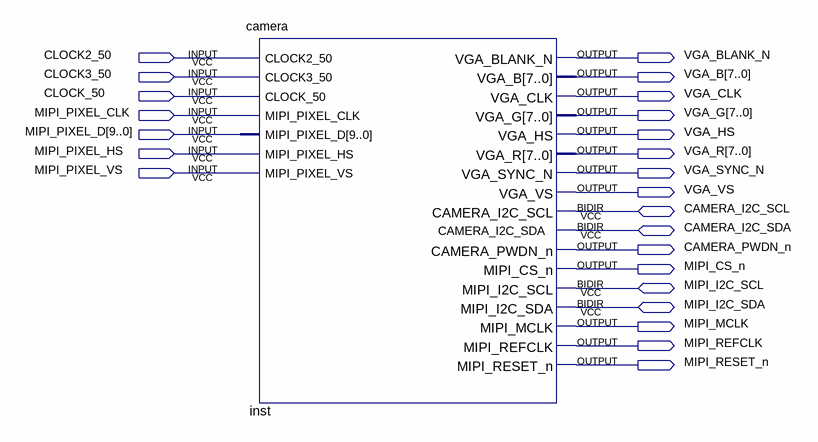
[diagram p0: schematic sheet]
// Quartus schematic test.bdf as structural Verilog: 1 symbols, 24 pins
module test (
  input  CLOCK2_50,
  input  CLOCK3_50,
  input  CLOCK_50,
  input  MIPI_PIXEL_CLK,
  input  [9:0] MIPI_PIXEL_D,
  input  MIPI_PIXEL_HS,
  input  MIPI_PIXEL_VS,
  inout  CAMERA_I2C_SCL,
  inout  CAMERA_I2C_SDA,
  inout  MIPI_I2C_SCL,
  inout  MIPI_I2C_SDA,
  output VGA_BLANK_N,
  output [7:0] VGA_B,
  output VGA_CLK,
  output [7:0] VGA_G,
  output VGA_HS,
  output [7:0] VGA_R,
  output VGA_SYNC_N,
  output VGA_VS,
  output CAMERA_PWDN_n,
  output MIPI_CS_n,
  output MIPI_MCLK,
  output MIPI_REFCLK,
  output MIPI_RESET_n
);

  camera inst (
    .CLOCK2_50(CLOCK2_50), .CLOCK3_50(CLOCK3_50), .CLOCK_50(CLOCK_50), .MIPI_PIXEL_CLK(MIPI_PIXEL_CLK),
    .MIPI_PIXEL_D(MIPI_PIXEL_D), .MIPI_PIXEL_HS(MIPI_PIXEL_HS), .MIPI_PIXEL_VS(MIPI_PIXEL_VS),
    .VGA_BLANK_N(VGA_BLANK_N), .VGA_B(VGA_B), .VGA_CLK(VGA_CLK), .VGA_G(VGA_G), .VGA_HS(VGA_HS),
    .VGA_R(VGA_R), .VGA_SYNC_N(VGA_SYNC_N), .VGA_VS(VGA_VS), .CAMERA_PWDN_n(CAMERA_PWDN_n),
    .MIPI_CS_n(MIPI_CS_n), .MIPI_MCLK(MIPI_MCLK), .MIPI_REFCLK(MIPI_REFCLK), .MIPI_RESET_n(MIPI_RESET_n),
    .CAMERA_I2C_SCL(CAMERA_I2C_SCL), .CAMERA_I2C_SDA(CAMERA_I2C_SDA), .MIPI_I2C_SCL(MIPI_I2C_SCL),
    .MIPI_I2C_SDA(MIPI_I2C_SDA));
endmodule
